# EAGLE design fp_usb2_ba (EAGLE 9.6.2)
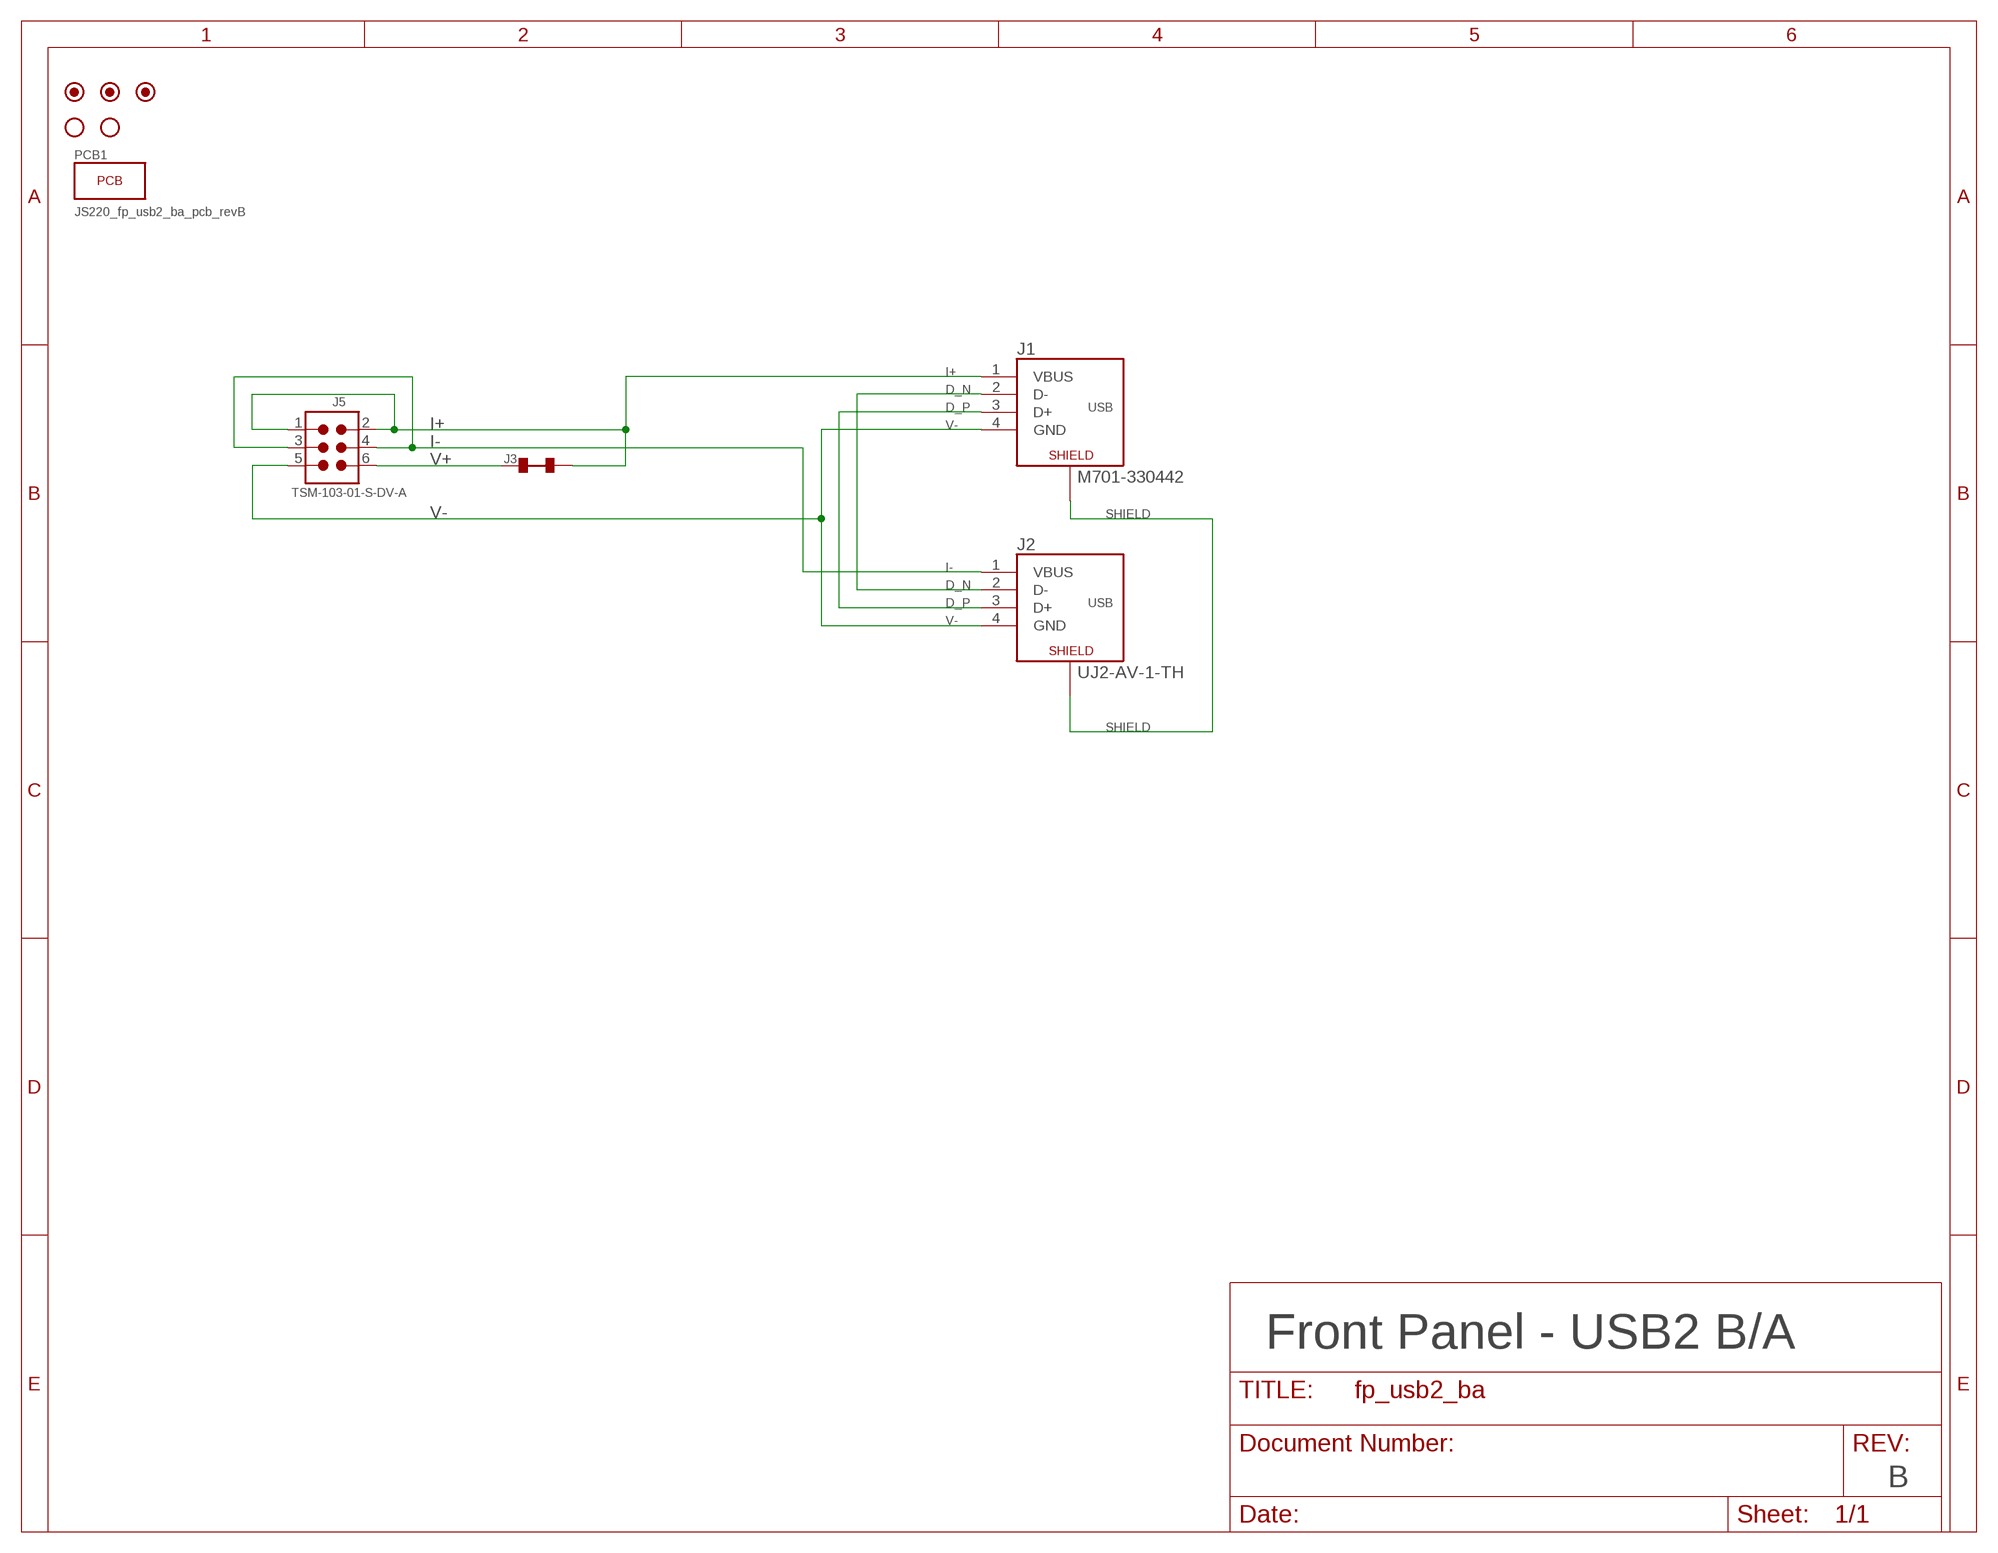
[diagram p0: schematic, sheet 1]
PCB1 (PCB): POPULATE: 1

## Parts
FUD1  FIDUCIAL_1MM  [FIDUCIAL_1MM_2MM]
FUD2  FIDUCIAL_1MM  [FIDUCIAL_1MM_2MM]
FUD3  FIDUCIAL_1MM  [FIDUCIAL_1MM_2MM]
H1  HOLE_#6_NORESTRICT  [HOLE_3.5MM_NORESTRICT]
H2  HOLE_#6_NORESTRICT  [HOLE_3.5MM_NORESTRICT]
J1  M701-330442  USB-4-B_VTH  [USB-B-VTH]
J2  UJ2-AV-1-TH  USB-4-A_VTH  [USB-A-VTH]
J3  TRACE_CUT0603  [J0603]
J5  TSM-103-01-S-DV-A  CONN_0.1_3X2_MSA  [CONN_0.1_3X2_MSA]

## Nets
D_N [USBD]: J1.2(D-) J2.2(D-)
D_P [USBD]: J1.3(D+) J2.3(D+)
I+: J1.1(VBUS) J3.2 J5.1 J5.2
I-: J2.1(VBUS) J5.3 J5.4
SHIELD: J1.SHIELD@1(SHIELD) J1.SHIELD@3(SHIELD) J2.SHIELD@1(SHIELD) J2.SHIELD@3(SHIELD)
V+: J3.1 J5.6
V-: J1.4(GND) J2.4(GND) J5.5

## Notes on the sheet
- Front Panel - USB2 B/A
- B

## Library data of the parts
FUD1-FUD3 = jetperch:FIDUCIAL; POPULATE: 0
H1 H2 = jetperch:HOLE; POPULATE: 0
J1 J2 = jetperch:USB-4: USB 2 4-pin connectors Use 5-pin connectors for OTG support USB-A-RCPT for Amphenol FCI 87583-3010RPALF USB-B for TE Connectivity 1-1734346-1; POPULATE: 1
J3 = jetperch:TRACE_CUT: A 2-terminal "device" that is connected by default with a trace. During development and debug, the trace can be cut and a part installed.; POPULATE: 0
J5 = jetperch:CONN_0.1_3X2; MPN: TSM-103-01-S-DV-A; POPULATE: 1

## Net classes
1 USBD: width 1.016 mm, clearance 0.152 mm to class 0, clearance 0.508 mm

## Board
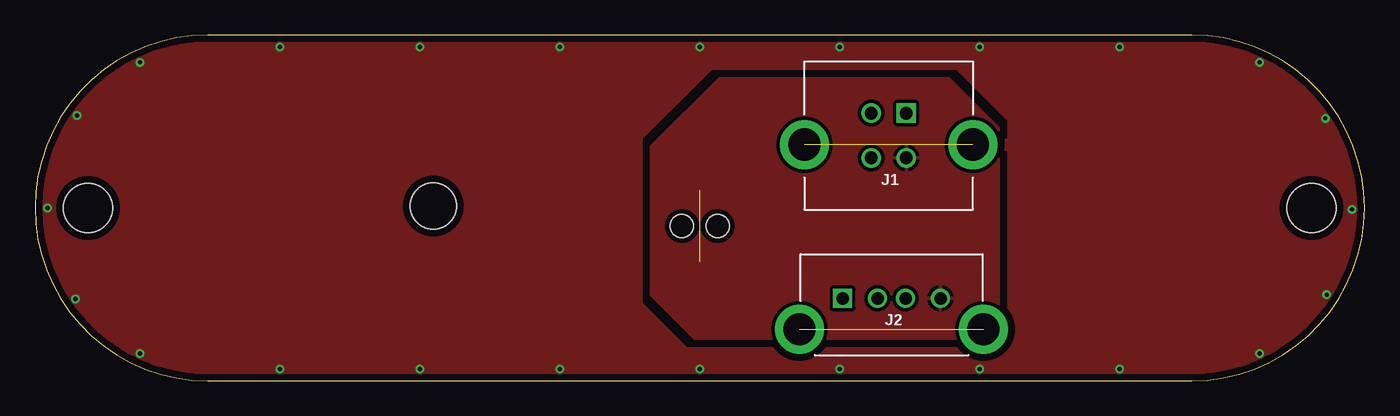
[diagram p1: board, top side]
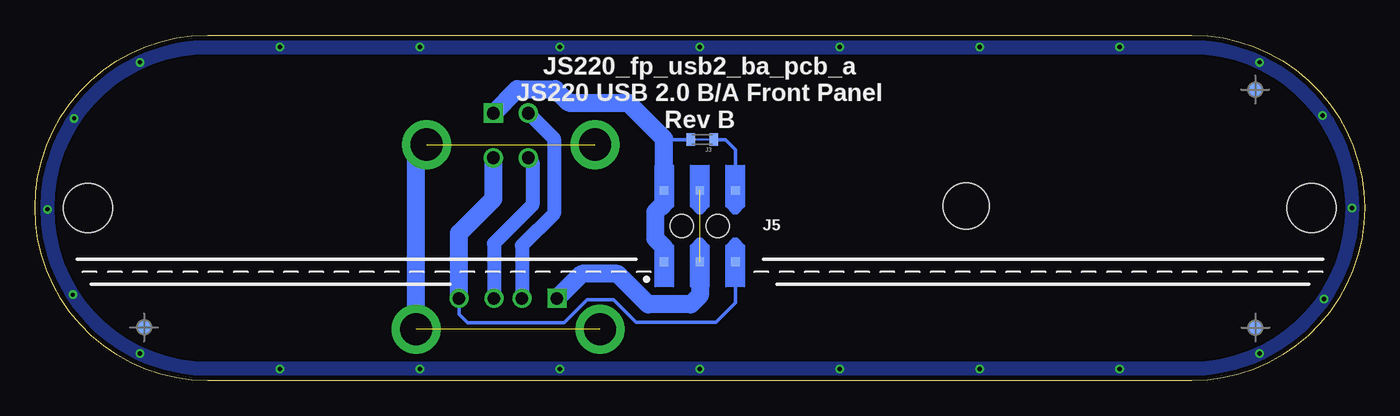
[diagram p2: board, bottom side, seen from below]

Size 95 x 24.7 mm. Coordinates in mm from the lower left corner, seen from the top.
Outline: 0,12.35 arc90 12.35,0 82.65,0 arc90 95,12.35 arc90 82.65,24.7 12.35,24.7 arc90 0,12.35
Copper layers (1*16): Top 0.035mm / dielectric 62mil / Bottom 0.035mm
Design rules "jetperch_2layer_oshpark": minimum track width 6mil, minimum drill 12mil, track to track 6mil, track to pad 6mil, pad to pad 6mil, via to via 6mil, smd to smd 0mil, copper to edge 15mil, drill to drill 15mil, minimum pad ring 6mil, minimum via ring 6mil, stop-mask expansion 2mil, vias tented up to drill 15mil, thermal gap 10mil
Holes 3.3 mm at 28.45,12.5

### Footprints (pad centres in the part's own frame; a part is rotated, then mirrored left to right if it is on the bottom)
FIDUCIAL_1MM_2MM = smd 1.016 x 1.016: P1 0,0
HOLE_3.5MM_NORESTRICT = hole 3.5: 0,0
USB-B-VTH = drill 0.92 square: 1 1.25,1.6 | drill 0.92: 2 -1.25,1.6; 3 -1.25,-1.6; 4 1.25,-1.6 | drill 2.3 pad 3.5: SHIELD@1 -6.02,-0.65; SHIELD@3 6.02,-0.65
USB-A-VTH = drill 0.9 square: 1 -3.5,0.45 | drill 0.9: 2 -1,0.45; 3 1,0.45; 4 3.5,0.45 | drill 2.3 pad 3.5: SHIELD@1 -6.57,-1.75; SHIELD@3 6.57,-1.75
J0603 = smd 0.6 x 0.9: 1 -0.825,0; 2 0.825,0
CONN_0.1_3X2_MSA = smd 0.635 x 0.635: 1 -2.54,-2.54; 2 -2.54,2.54; 3 0,-2.54; 4 0,2.54; 5 2.54,-2.54; 6 2.54,2.54 | hole 1.651: -1.27,0; 1.27,0

### Placement (x,y rotation side)
FUD1  7.79,3.79 0 bottom
FUD2  7.81,20.79 0 bottom
FUD3  87.21,3.81 0 bottom
H1  3.79,12.35 0 top
H2  91.21,12.35 0 top
J1  61,17.52 0 top
J2  61.2,5.44 0 top
J3  47.32,17.23 180 bottom
J5  47.5,11.06 0 bottom

### Tracks (layer width: path | path; a pad name or v marks a point on that pad's centre or on a via)
CGND  (via drill 0.3)
  other vias: 47.5,23.85 57.5,23.85 67.5,23.85 77.5,23.85 37.5,23.85 27.5,23.85 17.5,23.85 17.5,0.85 27.5,0.85 37.5,0.85 47.5,0.85 57.5,0.85 67.5,0.85 77.5,0.85 87.5,22.75 87.5,1.95 94.1,12.25 92.2,18.75 92.3,6.15 7.5,1.95 7.5,22.75 3,18.95 0.9,12.35 2.9,5.85
  pour Top (isolate 0.508, rank 6): 12.35,24.7 82.65,24.7 arc-90 95,12.35 arc-90 82.65,0 12.35,0 arc-90 0,12.35 arc-90
  pour Bottom (isolate 0.254): 48,0 12.35,0 arc-90 0,12.35 arc-90 12.35,24.7 47.5,24.7 47.5,23.45 12.35,23.45 arc90 1.25,12.35 arc90 12.35,1.25 47.5,1.25
  pour Bottom (isolate 0.254): 47.5,0 47.5,1.25 82.65,1.25 arc90 93.75,12.35 arc90 82.65,23.45 47.5,23.45 47.5,24.7 82.65,24.7 arc-90 95,12.35 arc-90 82.65,0
D_N
  Bottom 1.016: J1.2 57.93,17.3 57.93,11.94 60.2,9.67 J2.2
D_P
  Bottom 1.016: J1.3 59.45,15.63 59.45,12.57 62.2,9.82 J2.3
I+
  Bottom 0.254: J3.2 50,17.23 50.04,17.27
  Bottom 1.27: J5.1 50.04,9.53 50.67,10.16 50.67,12.06 50.04,12.7 J5.2 50.04,17.27 52.64,19.87 56.87,19.87 57.83,20.83 60.55,20.83 J1.1
I-  (1 unrouted)
  Bottom 1.016: J5.3
  Bottom 1.27: J5.3 47.5,6.09 48.13,5.46 51.18,5.46 53.37,7.64 55.95,7.64 J2.1
SHIELD  (2 unrouted)
  Bottom 1.27: J2.SHIELD@3 67.77,16.12 J1.SHIELD@3
V+
  Bottom 0.254: J5.6 44.96,16.51 45.68,17.23 J3.1
V-
  Bottom 0.254: J5.5 44.96,5.59 46.35,4.19 52.07,4.19 53.65,5.78 55.55,5.78 57.18,4.15 64.1,4.15 64.7,4.75 J2.4
  Bottom 1.27: J1.4 62.25,13 64.7,10.55 J2.4
  pour Top (isolate 0.254): 44.07,16.76 44.07,6.1 47.12,3.05 67.2,3.05 68.85,4.7 68.85,18.03 65.29,21.59 48.9,21.59

### Text on the board
bNames: JS220_fp_usb2_ba_pcb_a / JS220 USB 2.0 B/A Front Panel / Rev B
tStop: Host / computer | Sensor / Status | Device
Measures: Sensor Status | 2x holes
FabDoc1: All dimensions in millimeters | Place all markings on back (including pcb order number). / Add flammability rating marking on back, such as 94V-0. / The front-side surface is cosmetic - reject units with scratches and blemishes.